# Altium schematic sheet Power_Supply.SchDoc (part 1 of 2)
size A3; SheetNumber: 3; SheetTotal: 4
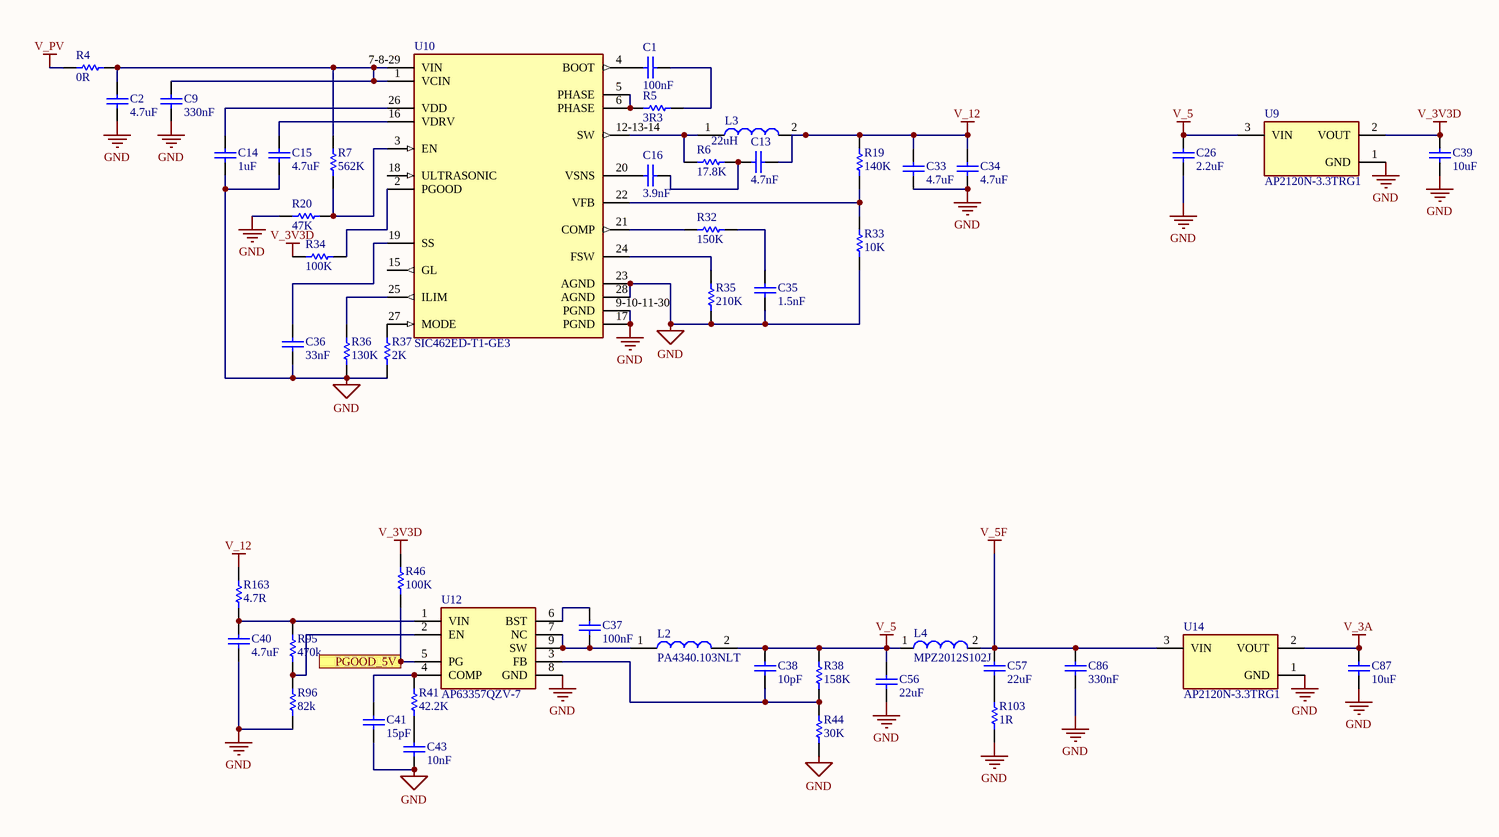
[diagram p0: Power_Supply.SchDoc]

## Parts
C1  100nF  [CAPC1005X56X25NL10T15]
C2  4.7uF  [CAPC3216X180X50NL20T25]
C9  330nF  [CAPC2013X140X50NL20T25]
C13  4.7nF  [CAPC1608X90X35NL10T15]
C14  1uF  [CAPC1608X90X35NL15T15]
C15  4.7uF  [CAPC2013X152X50NL20T25]
C16  3.9nF  [CAPC1608X90X35NL15T15]
C26  2.2uF  [CAPC2013X140X45NL15T25]
C33  4.7uF  [CAPC3216X180X50NL20T25]
C34  4.7uF  [CAPC3216X180X50NL20T25]
C35  1.5nF  [CAPC1608X90X35NL15T15]
C36  33nF  [CAPC1005X55X25NL05T10]
C37  100nF  [CAPC1005X56X25NL10T15]
C38  10pF  [CAPC1005X56X25NL10T15]
C39  10uF  [CAPC2013X140X45NL15T25]
C40  4.7uF  [CAPC3216X180X50NL20T25]
C41  15pF  [CAPC1005X56X25NL10T15]
C43  10nF  [CAPC1005X56X25NL10T15]
C56  22uF  [CAPC1206(3216)190_N]
C57  22uF  [CAPC1206(3216)190_M]
C86  330nF  [CAPC2013X140X45NL15T25]
C87  10uF  [CAPC2013X140X45NL15T25]
L2  PA4340.103NLT  [INDPM6054X300N]
L3  22uH  [INDPM8680X400N]
L4  MPZ2012S102J  [SMD-0805]
R4  0R  [RESC1608X55X25ML10T15]
R5  3R3  [RESC1005X40X25NL05T10]
R6  17.8K  [RESC1608X55X30NL15T15]
R7  562K  [RESC1609X50X30NL10T20]
R19  140K  [RESC1005X40X25NL05T05]
R20  47K  [RESC1608X55X30NL15T15]
R32  150K  [RESC1005X40X25NL05T05]
R33  10K  [RESC1005X40X25NL05T05]
R34  100K  [RESC1005X40X25NL05T10]
R35  210K  [RESC1005X40X25NL05T05]
R36  130K  [RESC1005X40X25NL05T10]
R37  2K  [RESC1005X40X25NL05T05]
R38  158K  [RESC1005X40X25NL05T05]
R41  42.2K  [RESC1005X40X25NL05T05]
R44  30K  [RESC1005X40X25NL05T05]
R46  100K  [RESC1005X40X25NL05T10]
R95  470k  [RESC1005X40X25NL05T05]
R96  82k  [RESC1005X40X25NL05T05]
R103  1R  [RESC2012X70N]
R163  4.7R  [RESC2013X70X40LL20T20]
U9  AP2120N-3.3TRG1  [FP-SOT23-MFG]
U10  SIC462ED-T1-GE3  [FP-T18-0594-MFG]
U12  AP63357QZV-7  [AP63357QZV7]
U14  AP2120N-3.3TRG1  [FP-SOT23-MFG]

## Ports
PGOOD_5V (out)

## Nets
GND: C2.1 C9.1 C14.1 C15.1 C26.1 C33.1 C34.1 C35.1 C36.1 C39.1 C40.1 C41.1 C43.1 C56.1 C86.1 C87.1 R20.1 R33.1 R35.1 R36.1 R37.1 R44.1 R96.1 R103.1 U9.1(GND) U10.9-10-11-30(PGND) U10.17(PGND) U10.23(AGND) U10.28(AGND) U12.8(GND) U14.1(GND)
V_3A: C87.2 U14.2(VOUT)
V_3V3D: C39.2 R34.1 R46.2 U9.2(VOUT)
V_5: C26.2 C38.2 C56.2 L2.2 L4.1 R38.2 U9.3(VIN)
V_5F: C57.1 C86.2 L4.2 U14.3(VIN)
V_12: C13.2 C33.2 C34.2 L3.2 R19.2 R163.2
V_PV: R4.2
PGOOD_5V: R46.1 U12.5(PG) ; port PGOOD_5V
NetC1_1: C1.1 U10.4(BOOT)
NetC1_2: C1.2 R5.2
NetC2_2: C2.2 C9.2 R4.1 R7.2 U10.1(VCIN) U10.7-8-29(VIN)
NetC13_1: C13.1 C16.2 R6.2
NetC14_2: C14.2 U10.26(VDD)
NetC15_2: C15.2 U10.16(VDRV)
NetC16_1: C16.1 U10.20(VSNS)
NetC35_2: C35.2 R32.1
NetC36_2: C36.2 U10.19(SS)
NetC37_1: C37.1 L2.1 U12.7(NC) U12.9(SW)
NetC37_2: C37.2 U12.6(BST)
NetC38_1: C38.1 R38.1 R44.2 U12.3(FB)
NetC40_2: C40.2 R95.2 R163.1 U12.1(VIN)
NetC41_2: C41.2 R41.2 U12.4(COMP)
NetC43_2: C43.2 R41.1
NetC57_2: C57.2 R103.2
NetL3_1: L3.1 R6.1 U10.12-13-14(SW)
NetR5_1: R5.1 U10.5(PHASE) U10.6(PHASE)
NetR7_1: R7.1 R20.2 U10.3(EN)
NetR19_1: R19.1 R33.2 U10.22(VFB)
NetR32_2: R32.2 U10.21(COMP)
NetR34_2: R34.2 U10.2(PGOOD)
NetR35_2: R35.2 U10.24(FSW)
NetR36_2: R36.2 U10.25(ILIM)
NetR37_2: R37.2 U10.27(MODE)
NetR95_1: R95.1 R96.2 U12.2(EN)

Not connected (* = marked no-connect by the designer): U10 15(GL) 18(ULTRASONIC)
## Library data of the parts
C1 C37 = CMP-2008-02800-1: AVX 0.1uF Multilayer Ceramic Capacitor (MLCC) 16 V dc 10% X7R dielectric 402 SMT max op. temp. +125C; Manufacturer: AVX Interconnect / Elco; Part Number: 0402YC104KAT2A; Voltage Rating: 16V; Supplier 1: Digi-Key; Supplier Part Number 1: 478-7888-1-ND; Manufacturer Part Number: 0402YC104KAT2A; RoHS: Yes; Category: Ceramic Capacitors; Stock 1: 72315; Pricing 1: 1=0.10000, 10=0.01600, 50=0.00860, 100=0.00700, 500=0.00500, 1000=0.00393, 2500=0.00358, 5000=0.00329 (USD); Mount: Surface Mount,PCB; Case/Package: 0402; Case Code (Metric): 1005; Case Code (Imperial): 0402; Dielectric Material: Ceramic; Contact Plating: Tin,Matte; Min Operating Temperature: -55°C; Max Operating Temperature: 125°C; Tolerance: 10%; Packaging: Tape and Reel; Capacitance: 100nF; Voltage Rating (DC): 16V; Dielectric: X7R; Voltage: 16V; Package Quantity: 1; Termination: SMD/SMT; Series: -; Construction: Flat; Length: 1mm; Width: 0.02inch; Height: 0.56mm; Thickness: 0.022inch; Depth: 0.5mm; Radiation Hardening: No; REACH SVHC: Unknown; RoHS Compliant: Yes; Lead Free: Lead Free; ComponentLink1URL: https://datasheet.ciiva.com/1123/1679506-1123956.pdf?src-supplier=Element14; ComponentLink1Description: https://datasheet.ciiva.com/1123/1679506-1123956.pdf?src-supplier=Element14; ComponentLink2URL: https://datasheet.ciiva.com/7614/cx7r-7614662.pdf?src-supplier=Digi-Key; ComponentLink2Description: https://datasheet.ciiva.com/7614/cx7r-7614662.pdf?src-supplier=Digi-Key; ComponentLink3URL: https://datasheet.ciiva.com/22693/1679506-22693578.pdf?src-supplier=Element14; ComponentLink3Description: https://datasheet.ciiva.com/22693/1679506-22693578.pdf?src-supplier=Element14; ComponentLink4URL: https://datasheet.ciiva.com/16623/cx7r-16623291.pdf?src-supplier=Avnet+Europe; ComponentLink4Description: https://datasheet.ciiva.com/16623/cx7r-16623291.pdf?src-supplier=Avnet+Europe; ComponentLink5URL: https://datasheet.ciiva.com/2987/cx7r-2987708.pdf?src-supplier=Avnet; ComponentLink5Description: https://datasheet.ciiva.com/2987/cx7r-2987708.pdf?src-supplier=Avnet; ComponentLink6URL: https://datasheet.ciiva.com/6265/cx7r-6265276.pdf?src-supplier=Digi-Key; ComponentLink6Description: https://datasheet.ciiva.com/6265/cx7r-6265276.pdf?src-supplier=Digi-Key; ComponentLink7URL: https://datasheet.ciiva.com/28613/1679506-28613260.pdf?src-supplier=Element14; ComponentLink7Description: https://datasheet.ciiva.com/28613/1679506-28613260.pdf?src-supplier=Element14; ComponentLink8URL: https://datasheet.ciiva.com/5411/cx7r-218113-5411197.pdf?src-supplier=Mouser; ComponentLink8Description: https://datasheet.ciiva.com/5411/cx7r-218113-5411197.pdf?src-supplier=Mouser; ComponentLink9URL: https://datasheet.ciiva.com/7709/1679506-7709566.pdf?src-supplier=Element14; ComponentLink9Description: https://datasheet.ciiva.com/7709/1679506-7709566.pdf?src-supplier=Element14
C2 C33 C34 C40 = CMP-2000-07581-1: Chip Capacitor, 4.7 uF, +/- 10%, 50 V, -55 to 125 degC, 1206 (3216 Metric), RoHS, Tape and Reel; Manufacturer: AVX; Manufacturer Part Number: 12065C475KAT2A; Voltage Rating: 50V; Case\/Package: 1206; Dissipation Factor: 2.5%; Dielectric: X7R; Case Code (Imperial): 1206; Tolerance: 10%; Radiation Hardening: No; Mount: SurfaceMount; Capacitance: 4.7uF; Width: 1.6mm; Manufacturer URL: http://www.avx.com/; RoHSCompliant: True; Thickness: 0.07inch; Depth: 1.6mm; Min Operating Temperature: -55degC; Package Reference: 1206; Voltage Rating (DC): 50V; Package Description: 2-Pin Surface Mount Device, Body 3.2 x 1.6 mm; Datasheet URL: http://datasheets.avx.com/X7RDielectric.pdf; Case Code (Metric): 3216; REACH SVHC: NoSVHC; Packaging: TapeandReel; Mounting Technology: SurfaceMount; Termination: SMD/SMT; Package Quantity: 1; Datasheet Version: 03/2017; Max Operating Temperature: 125degC; Contact Plating: Matte; Length: 3.2mm; Lead Free: LeadFree; Supplier 1: Digi-Key; Supplier Part Number 1: 478-6653-1-ND; RoHS: Yes; Category: Ceramic Capacitors; Stock 1: 241833; Pricing 1: 1=0.51000, 10=0.35400, 100=0.21250, 500=0.15940, 1000=0.13460 (USD); Case/Package: 1206; ComponentLink1URL: https://datasheet.ciiva.com/5410/cx7r-218113-5410549.pdf?src-supplier=Mouser; ComponentLink1Description: https://datasheet.ciiva.com/5410/cx7r-218113-5410549.pdf?src-supplier=Mouser; ComponentLink2URL: https://datasheet.ciiva.com/16387/flexiterm-16387141.pdf?src-supplier=Future+Electronics; ComponentLink2Description: https://datasheet.ciiva.com/16387/flexiterm-16387141.pdf?src-supplier=Future+Electronics; ComponentLink3URL: https://datasheet.ciiva.com/153/cx7r-153750.pdf?src-supplier=Digi-Key; ComponentLink3Description: https://datasheet.ciiva.com/153/cx7r-153750.pdf?src-supplier=Digi-Key; ComponentLink4URL: https://datasheet.ciiva.com/7833/cx7r-7833462.pdf?src-supplier=Element14; ComponentLink4Description: https://datasheet.ciiva.com/7833/cx7r-7833462.pdf?src-supplier=Element14; ComponentLink5URL: https://datasheet.ciiva.com/153/cx7r-153751.pdf?src-supplier=Digi-Key; ComponentLink5Description: https://datasheet.ciiva.com/153/cx7r-153751.pdf?src-supplier=Digi-Key; ComponentLink6URL: https://datasheet.ciiva.com/7833/cx7r-7833463.pdf?src-supplier=Element14; ComponentLink6Description: https://datasheet.ciiva.com/7833/cx7r-7833463.pdf?src-supplier=Element14; ComponentLink7URL: https://datasheet.ciiva.com/153/cx7r-153752.pdf?src-supplier=Digi-Key; ComponentLink7Description: https://datasheet.ciiva.com/153/cx7r-153752.pdf?src-supplier=Digi-Key
C9 = CMP-2007-03261-1: C0805C224K1RACAUTO; Manufacturer: Kemet; Dielectric Material: Ceramic; Tolerance: 10%; Capacitance: 220nF; Voltage Rating (DC): 100V; Dielectric: X7R; Part Number: C0805C224K1RACAUTO; Supplier 1: Digi-Key; Supplier Part Number 1: 399-6946-1-ND; Manufacturer Part Number: C0805C224K1RACAUTO; RoHS: Yes; Category: Ceramic Capacitors; Stock 1: 158113; Pricing 1: 1=0.37000, 10=0.25700, 100=0.15400, 500=0.11548, 1000=0.09752 (USD); Mount: Surface Mount; Case/Package: 0805; Case Code (Metric): 2012; Case Code (Imperial): 0805; Min Operating Temperature: -55°C; Max Operating Temperature: 125°C; Packaging: Tape and Reel; Voltage Rating: 100V; Package Quantity: 2500; Length: 2mm; Height: 1.25mm; Width: 0.049inch; Depth: 1.25mm; Thickness: 0.055inch; Ratings: AEC-Q200; Radiation Hardening: No; REACH SVHC: No SVHC; ComponentLink1URL: https://datasheet.ciiva.com/26948/getdatasheetpartid-385697-26948471.pdf?src-supplier=Verical; ComponentLink1Description: https://datasheet.ciiva.com/26948/getdatasheetpartid-385697-26948471.pdf?src-supplier=Verical; ComponentLink2URL: https://datasheet.ciiva.com/22699/1693454-22699750.pdf?src-supplier=Element14; ComponentLink2Description: https://datasheet.ciiva.com/22699/1693454-22699750.pdf?src-supplier=Element14; ComponentLink3URL: https://datasheet.ciiva.com/7842/1693454-7842284.pdf?src-supplier=Element14; ComponentLink3Description: https://datasheet.ciiva.com/7842/1693454-7842284.pdf?src-supplier=Element14
C13 = CMP-2006-02924-1: CAP CER 4700PF 50V X7R 0603; Part Number: GRM188R71H472KA01D; Manufacturer: Murata; Dielectric Material: Ceramic; Tolerance: 10%; Insulation Resistance: 10GR; Supplier 1: Farnell; Supplier Part Number 1: 8819971; Manufacturer Part Number: GRM188R71H472KA01D; RoHS: Yes; Category: Ceramic Capacitors; Pricing 1: 10=0.02680, 100=0.01390, 500=0.00940, 1000=0.00790, 2000=0.00690, 4000=0.00580, 20000=0.00430, 40000=0.00400 (GBP); Mount: Surface Mount; Case/Package: 0603; Number of Pins: 2; Case Code (Imperial): 0603; Case Code (Metric): 1608; Material: Ceramic; Min Operating Temperature: -55°C; Max Operating Temperature: 125°C; Capacitance: 4.7nF; Voltage Rating: 50V; Voltage Rating (DC): 50V; Packaging: Tape and Reel; Dielectric: X7R; Voltage: 50V; Series: GRM; Package Quantity: 1; Termination: SMD/SMT; Length: 1.6mm; Width: 0.8mm; Height: 0.8mm; Depth: 0.8mm; Thickness: 0.035inch; Radiation Hardening: No; RoHS Compliant: Yes; REACH SVHC: No SVHC; Lead Free: Lead Free; ComponentLink1URL: https://datasheet.ciiva.com/5412/product-5412608.pdf?src-supplier=Mouser; ComponentLink1Description: https://datasheet.ciiva.com/5412/product-5412608.pdf?src-supplier=Mouser; ComponentLink2URL: https://datasheet.ciiva.com/18102/getdatasheetpartid-75298-18102657.pdf?src-supplier=Verical; ComponentLink2Description: https://datasheet.ciiva.com/18102/getdatasheetpartid-75298-18102657.pdf?src-supplier=Verical; ComponentLink3URL: https://datasheet.ciiva.com/11787/0900766b8003061f-11787116.pdf?src-supplier=RSComponents; ComponentLink3Description: https://datasheet.ciiva.com/11787/0900766b8003061f-11787116.pdf?src-supplier=RSComponents; ComponentLink4URL: https://datasheet.ciiva.com/29201/451888-da-01-en-vs-kondensator-0603-29201828.pdf?src-supplier=Conrad; ComponentLink4Description: https://datasheet.ciiva.com/29201/451888-da-01-en-vs-kondensator-0603-29201828.pdf?src-supplier=Conrad; ComponentLink5URL: https://datasheet.ciiva.com/7937/4360-7937669.pdf?src-supplier=Element14; ComponentLink5Description: https://datasheet.ciiva.com/7937/4360-7937669.pdf?src-supplier=Element14; ComponentLink6URL: https://datasheet.ciiva.com/48428/nmgrm-data-en-48428597.pdf?src-supplier=Distrelec; ComponentLink6Description: https://datasheet.ciiva.com/48428/nmgrm-data-en-48428597.pdf?src-supplier=Distrelec; ComponentLink7URL: https://datasheet.ciiva.com/7937/4360-7937670.pdf?src-supplier=Element14; ComponentLink7Description: https://datasheet.ciiva.com/7937/4360-7937670.pdf?src-supplier=Element14; ComponentLink8URL: https://datasheet.ciiva.com/7937/4360-7937671.pdf?src-supplier=Element14; ComponentLink8Description: https://datasheet.ciiva.com/7937/4360-7937671.pdf?src-supplier=Element14; ComponentLink9URL: https://datasheet.ciiva.com/130/partnumbering-e-01-130733.pdf?src-supplier=Digi-Key; ComponentLink9Description: https://datasheet.ciiva.com/130/partnumbering-e-01-130733.pdf?src-supplier=Digi-Key; ComponentLink10URL: https://datasheet.ciiva.com/130/partnumbering-e-01-130734.pdf?src-supplier=Digi-Key; ComponentLink10Description: https://datasheet.ciiva.com/130/partnumbering-e-01-130734.pdf?src-supplier=Digi-Key; ComponentLink11URL: https://datasheet.ciiva.com/130/partnumbering-e-01-130735.pdf?src-supplier=Digi-Key; ComponentLink11Description: https://datasheet.ciiva.com/130/partnumbering-e-01-130735.pdf?src-supplier=Digi-Key
C14 = CMP-2006-02293-1: SMD, 1 µF, 10 V, 0603 [Metrisch 1608], ± 10%, X7R; Manufacturer: Kemet; Part Number: C0603C105K8RACTU; Dielectric Material: Ceramic; Voltage Rating: 10V; Dissipation Factor: 5%; Supplier 1: Digi-Key; Supplier Part Number 1: 399-11133-1-ND; Manufacturer Part Number: C0603C105K8RACTU; RoHS: Yes; Category: Ceramic Capacitors; Stock 1: 469408; Pricing 1: 1=0.10000, 10=0.05900, 50=0.03240, 100=0.02640, 500=0.01886, 1000=0.01482 (USD); Mount: Surface Mount; Case/Package: 0603; Case Code (Imperial): 0603; Case Code (Metric): 1608; Contact Plating: Tin,Matte; Min Operating Temperature: -55°C; Max Operating Temperature: 125°C; Packaging: Tape and Reel; Capacitance: 1uF; Package Quantity: 1; Voltage Rating (DC): 10V; Tolerance: 10%; Dielectric: X7R; Termination: SMD/SMT; Series: -; Construction: Flat; Length: 1.6mm; Width: 0.8mm; Height: 0.8mm; Thickness: 0.035inch; Depth: 0.8mm; Radiation Hardening: No; REACH SVHC: No SVHC; RoHS Compliant: Yes; ComponentLink1URL: https://datasheet.ciiva.com/18192/getdatasheetpartid-212378-18192743.pdf?src-supplier=Verical; ComponentLink1Description: https://datasheet.ciiva.com/18192/getdatasheetpartid-212378-18192743.pdf?src-supplier=Verical
C15 = CMP-2007-04518-1: Part Number: 0805YC475KAT2A; Manufacturer: AVX Interconnect / Elco; Tolerance: 10%; Voltage Rating (DC): 16V; Dielectric: X7R; Voltage: 10V; Dissipation Factor: 3.5%; Supplier 1: Digi-Key; Supplier Part Number 1: 478-5722-1-ND; Manufacturer Part Number: 0805YC475KAT2A; RoHS: Yes; Category: Ceramic Capacitors; Stock 1: 94071; Pricing 1: 1=0.46000, 10=0.31900, 50=0.22320, 100=0.19120, 500=0.14342, 1000=0.12112 (USD); Mount: Surface Mount; Case/Package: 0805; Number of Pins: 2; Case Code (Metric): 2012; Case Code (Imperial): 0805; Contact Plating: Tin,Matte; Min Operating Temperature: -55°C; Max Operating Temperature: 125°C; Package Quantity: 1; Capacitance: 4.7uF; Packaging: Tape and Reel; Termination: SMD/SMT; Voltage Rating: 16V; Series: -; Construction: Flat; Length: 2.01mm; Width: 0.049inch; Height: 1.52mm; Depth: 1.25mm; Thickness: 0.06inch; Radiation Hardening: No; REACH SVHC: No SVHC; Lead Free: Lead Free; RoHS Compliant: Yes; ComponentLink1URL: https://datasheet.ciiva.com/11787/0900766b80dc2409-11787157.pdf?src-supplier=RSComponents; ComponentLink1Description: https://datasheet.ciiva.com/11787/0900766b80dc2409-11787157.pdf?src-supplier=RSComponents; ComponentLink2URL: https://datasheet.ciiva.com/154/cx7r-154080.pdf?src-supplier=Digi-Key; ComponentLink2Description: https://datasheet.ciiva.com/154/cx7r-154080.pdf?src-supplier=Digi-Key; ComponentLink3URL: https://datasheet.ciiva.com/154/cx7r-154081.pdf?src-supplier=Digi-Key; ComponentLink3Description: https://datasheet.ciiva.com/154/cx7r-154081.pdf?src-supplier=Digi-Key; ComponentLink4URL: https://datasheet.ciiva.com/7812/cx7r-7812213.pdf?src-supplier=Element14; ComponentLink4Description: https://datasheet.ciiva.com/7812/cx7r-7812213.pdf?src-supplier=Element14; ComponentLink5URL: https://datasheet.ciiva.com/7812/cx7r-7812214.pdf?src-supplier=Element14; ComponentLink5Description: https://datasheet.ciiva.com/7812/cx7r-7812214.pdf?src-supplier=Element14; ComponentLink6URL: https://datasheet.ciiva.com/5414/cx7r-218113-5414810.pdf?src-supplier=Mouser; ComponentLink6Description: https://datasheet.ciiva.com/5414/cx7r-218113-5414810.pdf?src-supplier=Mouser; ComponentLink7URL: https://datasheet.ciiva.com/2988/cx7r-2988060.pdf?src-supplier=Avnet; ComponentLink7Description: https://datasheet.ciiva.com/2988/cx7r-2988060.pdf?src-supplier=Avnet; ComponentLink8URL: https://datasheet.ciiva.com/16389/cx7r-16389021.pdf?src-supplier=Future+Electronics; ComponentLink8Description: https://datasheet.ciiva.com/16389/cx7r-16389021.pdf?src-supplier=Future+Electronics; ComponentLink9URL: https://datasheet.ciiva.com/154/cx7r-154079.pdf?src-supplier=Digi-Key; ComponentLink9Description: https://datasheet.ciiva.com/154/cx7r-154079.pdf?src-supplier=Digi-Key; ComponentLink10URL: https://datasheet.ciiva.com/11570/cx7r-11570847.pdf?src-supplier=Avnet; ComponentLink10Description: https://datasheet.ciiva.com/11570/cx7r-11570847.pdf?src-supplier=Avnet
C16 = CMP-2006-04096-1: Part Number: 06031C392KAT2A; Manufacturer: AVX Interconnect / Elco; Dielectric Material: Ceramic; Tolerance: 10%; Voltage Rating (DC): 100V; Dielectric: X7R; Dissipation Factor: 2.5%; Supplier 1: Digi-Key; Supplier Part Number 1: 478-5001-1-ND; Manufacturer Part Number: 06031C392KAT2A; RoHS: Yes; Category: Ceramic Capacitors; Stock 1: 3576; Pricing 1: 1=0.23000, 10=0.15700, 50=0.09400, 100=0.07940, 500=0.05434, 1000=0.04807 (USD); Mount: Surface Mount,PCB; Case/Package: 0603; Number of Pins: 2; Case Code (Metric): 1608; Case Code (Imperial): 0603; Min Operating Temperature: -55°C; Max Operating Temperature: 125°C; Capacitance: 3.9nF; Packaging: Tape and Reel; Termination: SMD/SMT; Voltage Rating: 100V; Package Quantity: 1; Series: -; Construction: Flat; Voltage: 100V; Length: 1.6mm; Width: 0.032inch; Height: 0.86mm; Thickness: 0.035inch; Depth: 0.81mm; Radiation Hardening: No; RoHS Compliant: Yes; Lead Free: Lead Free; REACH SVHC: No SVHC; ComponentLink1URL: https://datasheet.ciiva.com/151/cx7r-151072.pdf?src-supplier=Digi-Key; ComponentLink1Description: https://datasheet.ciiva.com/151/cx7r-151072.pdf?src-supplier=Digi-Key; ComponentLink2URL: https://datasheet.ciiva.com/151/cx7r-151073.pdf?src-supplier=Digi-Key; ComponentLink2Description: https://datasheet.ciiva.com/151/cx7r-151073.pdf?src-supplier=Digi-Key; ComponentLink3URL: https://datasheet.ciiva.com/151/cx7r-151074.pdf?src-supplier=Digi-Key; ComponentLink3Description: https://datasheet.ciiva.com/151/cx7r-151074.pdf?src-supplier=Digi-Key; ComponentLink4URL: https://datasheet.ciiva.com/6013/84526-6013797.pdf?src-supplier=Farnell; ComponentLink4Description: https://datasheet.ciiva.com/6013/84526-6013797.pdf?src-supplier=Farnell; ComponentLink5URL: https://datasheet.ciiva.com/5416/cx7r-218113-5416073.pdf?src-supplier=Mouser; ComponentLink5Description: https://datasheet.ciiva.com/5416/cx7r-218113-5416073.pdf?src-supplier=Mouser; ComponentLink6URL: https://datasheet.ciiva.com/16214/cx7r-16214154.pdf?src-supplier=Future+Electronics; ComponentLink6Description: https://datasheet.ciiva.com/16214/cx7r-16214154.pdf?src-supplier=Future+Electronics; ComponentLink7URL: https://datasheet.ciiva.com/7855/84526-7855211.pdf?src-supplier=Element14; ComponentLink7Description: https://datasheet.ciiva.com/7855/84526-7855211.pdf?src-supplier=Element14; ComponentLink8URL: https://datasheet.ciiva.com/15212/getdatasheetpartid-150519-15212187.pdf?src-supplier=Verical; ComponentLink8Description: https://datasheet.ciiva.com/15212/getdatasheetpartid-150519-15212187.pdf?src-supplier=Verical; ComponentLink9URL: https://datasheet.ciiva.com/1124/1679506-1124300.pdf?src-supplier=Element14; ComponentLink9Description: https://datasheet.ciiva.com/1124/1679506-1124300.pdf?src-supplier=Element14; ComponentLink10URL: https://datasheet.ciiva.com/1124/1679506-1124301.pdf?src-supplier=Element14; ComponentLink10Description: https://datasheet.ciiva.com/1124/1679506-1124301.pdf?src-supplier=Element14
C26 C39 C86 C87 = CMP-2007-03395-1: Part Number: GRM21BR71A106KE51L; Manufacturer: Murata
C35 = CMP-2006-04080-1: Part Number: 06031C152JAT2A; Manufacturer: AVX Interconnect / Elco; Dielectric Material: Ceramic; Tolerance: 5%; Dielectric: X7R; Voltage Rating (DC): 100V; Supplier 1: Digi-Key; Supplier Part Number 1: 478-3703-1-ND; Manufacturer Part Number: 06031C152JAT2A; RoHS: Yes; Category: Ceramic Capacitors; Stock 1: 7561; Pricing 1: 1=0.29000, 10=0.20000, 50=0.12020, 100=0.10160, 500=0.06950, 1000=0.06148 (USD); Mount: Surface Mount,PCB; Case/Package: 0603; Number of Pins: 2; Case Code (Imperial): 0603; Case Code (Metric): 1608; Min Operating Temperature: -55°C; Max Operating Temperature: 125°C; Capacitance: 1.5nF; Packaging: Tape and Reel; Termination: SMD/SMT; Package Quantity: 1; Voltage Rating: 100V; Series: -; Construction: Flat; Voltage: 100V; Length: 1.6mm; Width: 0.81mm; Height: 0.9mm; Depth: 0.81mm; Thickness: 0.035inch; Radiation Hardening: No; RoHS Compliant: Yes; REACH SVHC: No SVHC; Lead Free: Lead Free; ComponentLink1URL: https://datasheet.ciiva.com/5418/cx7r-218113-5418085.pdf?src-supplier=Mouser; ComponentLink1Description: https://datasheet.ciiva.com/5418/cx7r-218113-5418085.pdf?src-supplier=Mouser; ComponentLink2URL: https://datasheet.ciiva.com/151/cx7r-151639.pdf?src-supplier=Digi-Key; ComponentLink2Description: https://datasheet.ciiva.com/151/cx7r-151639.pdf?src-supplier=Digi-Key; ComponentLink3URL: https://datasheet.ciiva.com/14591/70001075-14591735.pdf?src-supplier=Allied+Electronics; ComponentLink3Description: https://datasheet.ciiva.com/14591/70001075-14591735.pdf?src-supplier=Allied+Electronics; ComponentLink4URL: https://datasheet.ciiva.com/151/cx7r-151640.pdf?src-supplier=Digi-Key; ComponentLink4Description: https://datasheet.ciiva.com/151/cx7r-151640.pdf?src-supplier=Digi-Key; ComponentLink5URL: https://datasheet.ciiva.com/6106/84526-6106520.pdf?src-supplier=Farnell; ComponentLink5Description: https://datasheet.ciiva.com/6106/84526-6106520.pdf?src-supplier=Farnell; ComponentLink6URL: https://datasheet.ciiva.com/151/cx7r-151641.pdf?src-supplier=Digi-Key; ComponentLink6Description: https://datasheet.ciiva.com/151/cx7r-151641.pdf?src-supplier=Digi-Key; ComponentLink7URL: https://datasheet.ciiva.com/11499/cx7r-11499674.pdf?src-supplier=Avnet; ComponentLink7Description: https://datasheet.ciiva.com/11499/cx7r-11499674.pdf?src-supplier=Avnet; ComponentLink8URL: https://datasheet.ciiva.com/1124/1679506-1124251.pdf?src-supplier=Element14; ComponentLink8Description: https://datasheet.ciiva.com/1124/1679506-1124251.pdf?src-supplier=Element14; ComponentLink9URL: https://datasheet.ciiva.com/1124/1679506-1124252.pdf?src-supplier=Element14; ComponentLink9Description: https://datasheet.ciiva.com/1124/1679506-1124252.pdf?src-supplier=Element14; ComponentLink10URL: https://datasheet.ciiva.com/7855/1679506-7855036.pdf?src-supplier=Element14; ComponentLink10Description: https://datasheet.ciiva.com/7855/1679506-7855036.pdf?src-supplier=Element14; ComponentLink11URL: https://datasheet.ciiva.com/7855/84526-7855198.pdf?src-supplier=Element14; ComponentLink11Description: https://datasheet.ciiva.com/7855/84526-7855198.pdf?src-supplier=Element14; ComponentLink12URL: https://datasheet.ciiva.com/16623/cx7r-16623310.pdf?src-supplier=Avnet+Europe; ComponentLink12Description: https://datasheet.ciiva.com/16623/cx7r-16623310.pdf?src-supplier=Avnet+Europe
C36 = CMP-1034-01988-2: Part Number: GRM155R71E333KA88D; Manufacturer: Murata; Material: Ceramic; Voltage Rating: 25V; Tolerance: 10%; Dielectric: X7R; Supplier 1: Digi-Key; Supplier Part Number 1: 490-3253-1-ND; Manufacturer Part Number: GRM155R71E333KA88D; RoHS: Yes; Category: Ceramic Capacitors; Stock 1: 49115; Pricing 1: 1=0.10000, 10=0.07100, 50=0.03900, 100=0.03180, 500=0.02272, 1000=0.01785, 2500=0.01622, 5000=0.01493 (USD); Mount: Surface Mount; Case/Package: 0402; Number of Pins: 2; Case Code (Imperial): 0402; Case Code (Metric): 1005; Min Operating Temperature: -55°C; Max Operating Temperature: 125°C; Capacitance: 33nF; Packaging: Tape and Reel; Voltage Rating (DC): 25V; Package Quantity: 1; Termination: SMD/SMT; Voltage: 25V; Length: 1mm; Width: 0.02inch; Height: 0.5mm; Thickness: 0.022inch; Depth: 0.5mm; Radiation Hardening: No; RoHS Compliant: Yes; Lead Free: Lead Free; REACH SVHC: No SVHC; ComponentLink1URL: https://datasheet.ciiva.com/131/product-131792.pdf?src-supplier=Digi-Key; ComponentLink1Description: https://datasheet.ciiva.com/131/product-131792.pdf?src-supplier=Digi-Key; ComponentLink2URL: https://datasheet.ciiva.com/18184/getdatasheetpartid-153135-18184704.pdf?src-supplier=Verical; ComponentLink2Description: https://datasheet.ciiva.com/18184/getdatasheetpartid-153135-18184704.pdf?src-supplier=Verical; ComponentLink3URL: https://datasheet.ciiva.com/19467/1856417-19467732.pdf?src-supplier=Jameco; ComponentLink3Description: https://datasheet.ciiva.com/19467/1856417-19467732.pdf?src-supplier=Jameco; ComponentLink4URL: https://datasheet.ciiva.com/29199/454166-da-01-en-vs-kondensator-0402-29199822.pdf?src-supplier=Conrad; ComponentLink4Description: https://datasheet.ciiva.com/29199/454166-da-01-en-vs-kondensator-0402-29199822.pdf?src-supplier=Conrad; ComponentLink5URL: https://datasheet.ciiva.com/2989/product-2989392.pdf?src-supplier=Avnet; ComponentLink5Description: https://datasheet.ciiva.com/2989/product-2989392.pdf?src-supplier=Avnet; ComponentLink6URL: https://datasheet.ciiva.com/131/grm155r71e333ka88-01-131793.pdf?src-supplier=Digi-Key; ComponentLink6Description: https://datasheet.ciiva.com/131/grm155r71e333ka88-01-131793.pdf?src-supplier=Digi-Key; ComponentLink7URL: https://datasheet.ciiva.com/131/grm155r71e333ka88-01-131794.pdf?src-supplier=Digi-Key; ComponentLink7Description: https://datasheet.ciiva.com/131/grm155r71e333ka88-01-131794.pdf?src-supplier=Digi-Key; ComponentLink8URL: https://datasheet.ciiva.com/7937/608985-7937622.pdf?src-supplier=Element14; ComponentLink8Description: https://datasheet.ciiva.com/7937/608985-7937622.pdf?src-supplier=Element14; ComponentLink9URL: https://datasheet.ciiva.com/14103/grmseries-highdielectrictype-eng-14103753.pdf?src-supplier=Distrelec; ComponentLink9Description: https://datasheet.ciiva.com/14103/grmseries-highdielectrictype-eng-14103753.pdf?src-supplier=Distrelec; ComponentLink10URL: https://datasheet.ciiva.com/16208/product-16208394.pdf?src-supplier=Future+Electronics; ComponentLink10Description: https://datasheet.ciiva.com/16208/product-16208394.pdf?src-supplier=Future+Electronics; ComponentLink11URL: https://datasheet.ciiva.com/2989/product-2989391.pdf?src-supplier=Avnet; ComponentLink11Description: https://datasheet.ciiva.com/2989/product-2989391.pdf?src-supplier=Avnet
C38 = CMP-2008-02563-1: CERAMIC CAPACITOR, 10PF, 50V, C0G, 5%, SMD, FULL REEL; Product Range:-; Capacitance:10pF; Capacitance Tolerance: 5%; Dielectric Characteristic:C0G / NP0; Voltage Rating:50V; Ceramic Capacitor Case:0402 [1005 Metric]; No. of Pins:2 ;RoHS Compliant: Yes; Part Number: 04025A100DAT2A; Manufacturer: AVX Interconnect / Elco; Temperature Coefficient: 30ppm/°C; Supplier 1: Digi-Key; Supplier Part Number 1: 478-7870-1-ND; Manufacturer Part Number: 04025A100DAT2A; RoHS: Yes; Category: Ceramic Capacitors; Stock 1: 172687; Pricing 1: 1=0.30000, 10=0.20700, 50=0.13800, 100=0.11730, 500=0.08280, 1000=0.07245, 2500=0.06900, 5000=0.06382 (USD); Mount: Surface Mount; Case/Package: 0402; Number of Pins: 2; Case Code (Metric): 1005; Case Code (Imperial): 0402; Dielectric Material: Ceramic; Contact Plating: Tin,Matte; Min Operating Temperature: -55°C; Max Operating Temperature: 125°C; Capacitance: 10pF; Voltage Rating: 50V; Voltage Rating (DC): 50V; Package Quantity: 1; Packaging: Tape and Reel; Dielectric: C0G; Termination: SMD/SMT; Series: -; Tolerance: 5%; Construction: Flat; Voltage: 50V; Length: 1mm; Width: 0.02inch; Height: 0.56mm; Depth: 0.5mm; Thickness: 0.022inch; Radiation Hardening: No; RoHS Compliant: Yes; REACH SVHC: No SVHC; Lead Free: Lead Free; ComponentLink1URL: https://datasheet.ciiva.com/11788/0900766b80def0e2-11788539.pdf?src-supplier=RSComponents; ComponentLink1Description: https://datasheet.ciiva.com/11788/0900766b80def0e2-11788539.pdf?src-supplier=RSComponents; ComponentLink2URL: https://datasheet.ciiva.com/2990/ccog-2990165.pdf?src-supplier=Avnet; ComponentLink2Description: https://datasheet.ciiva.com/2990/ccog-2990165.pdf?src-supplier=Avnet; ComponentLink3URL: https://datasheet.ciiva.com/16623/ccog-16623350.pdf?src-supplier=Avnet+Europe; ComponentLink3Description: https://datasheet.ciiva.com/16623/ccog-16623350.pdf?src-supplier=Avnet+Europe; ComponentLink4URL: https://datasheet.ciiva.com/14906/ccog-14906265.pdf?src-supplier=Digi-Key; ComponentLink4Description: https://datasheet.ciiva.com/14906/ccog-14906265.pdf?src-supplier=Digi-Key; ComponentLink5URL: https://datasheet.ciiva.com/206/ccog-206459.pdf?src-supplier=Digi-Key; ComponentLink5Description: https://datasheet.ciiva.com/206/ccog-206459.pdf?src-supplier=Digi-Key; ComponentLink6URL: https://datasheet.ciiva.com/14906/ccog-14906267.pdf?src-supplier=Digi-Key; ComponentLink6Description: https://datasheet.ciiva.com/14906/ccog-14906267.pdf?src-supplier=Digi-Key; ComponentLink7URL: https://datasheet.ciiva.com/1123/ccog-1123468.pdf?src-supplier=Element14; ComponentLink7Description: https://datasheet.ciiva.com/1123/ccog-1123468.pdf?src-supplier=Element14; ComponentLink8URL: https://datasheet.ciiva.com/1123/ccog-1123469.pdf?src-supplier=Element14; ComponentLink8Description: https://datasheet.ciiva.com/1123/ccog-1123469.pdf?src-supplier=Element14
C41 = CMP-1034-00812-2: Cap Ceramic 15pF 50V C0G 1% SMD 0402 125C Paper T/R; Manufacturer: AVX Interconnect / Elco; Part Number: 04025A150FAT2A; Supplier 1: Digi-Key; Supplier Part Number 1: 478-5126-1-ND; Manufacturer Part Number: 04025A150FAT2A; RoHS: Yes; Category: Ceramic Capacitors; Stock 1: 101927; Pricing 1: 1=0.57000, 10=0.40100, 50=0.30300, 100=0.26390, 500=0.19550, 1000=0.16618, 2500=0.15640, 5000=0.14662 (USD); Mount: Surface Mount,PCB; Case/Package: 0402; Number of Pins: 2; Case Code (Metric): 1005; Case Code (Imperial): 0402; Dielectric Material: Ceramic; Min Operating Temperature: -55°C; Max Operating Temperature: 125°C; Package Quantity: 1; Capacitance: 15pF; Voltage Rating: 50V; Tolerance: 1%; Packaging: Tape and Reel; Voltage Rating (DC): 50V; Dielectric: C0G; Termination: SMD/SMT; Series: -; Construction: Flat; Voltage: 50V; Length: 1mm; Width: 0.02inch; Height: 0.56mm; Depth: 0.5mm; Thickness: 0.022inch; Radiation Hardening: No; REACH SVHC: No SVHC; Lead Free: Lead Free; RoHS Compliant: Yes; ComponentLink1URL: https://datasheet.ciiva.com/26927/getdatasheetpartid-379176-26927300.pdf?src-supplier=Verical; ComponentLink1Description: https://datasheet.ciiva.com/26927/getdatasheetpartid-379176-26927300.pdf?src-supplier=Verical; ComponentLink2URL: https://datasheet.ciiva.com/157/ccog-157986.pdf?src-supplier=Digi-Key; ComponentLink2Description: https://datasheet.ciiva.com/157/ccog-157986.pdf?src-supplier=Digi-Key; ComponentLink3URL: https://datasheet.ciiva.com/157/ccog-157987.pdf?src-supplier=Digi-Key; ComponentLink3Description: https://datasheet.ciiva.com/157/ccog-157987.pdf?src-supplier=Digi-Key; ComponentLink4URL: https://datasheet.ciiva.com/157/ccog-157988.pdf?src-supplier=Digi-Key; ComponentLink4Description: https://datasheet.ciiva.com/157/ccog-157988.pdf?src-supplier=Digi-Key; ComponentLink5URL: https://datasheet.ciiva.com/14603/70001039-14603477.pdf?src-supplier=Allied+Electronics; ComponentLink5Description: https://datasheet.ciiva.com/14603/70001039-14603477.pdf?src-supplier=Allied+Electronics; ComponentLink6URL: https://datasheet.ciiva.com/28453/1796416-28453769.pdf?src-supplier=Element14; ComponentLink6Description: https://datasheet.ciiva.com/28453/1796416-28453769.pdf?src-supplier=Element14; ComponentLink7URL: https://datasheet.ciiva.com/22619/1796416-22619722.pdf?src-supplier=Element14; ComponentLink7Description: https://datasheet.ciiva.com/22619/1796416-22619722.pdf?src-supplier=Element14; ComponentLink8URL: https://datasheet.ciiva.com/11568/ccog-11568587.pdf?src-supplier=Avnet; ComponentLink8Description: https://datasheet.ciiva.com/11568/ccog-11568587.pdf?src-supplier=Avnet
C43 = CMP-2008-02925-1: Manufacturer: AVX Interconnect / Elco; Part Number: 04023C103JAT2A; Tolerance: 5%; Voltage Rating: 25V; Dielectric: X7R; Supplier 1: Digi-Key; Supplier Part Number 1: 478-7867-1-ND; Manufacturer Part Number: 04023C103JAT2A; RoHS: Yes; Category: Ceramic Capacitors; Stock 1: 9321; Pricing 1: 1=0.35000, 10=0.24300, 50=0.16980, 100=0.14560, 500=0.10920, 1000=0.09221, 2500=0.08735, 5000=0.08250 (USD); Mount: Surface Mount; Case/Package: 0402; Number of Pins: 2; Case Code (Imperial): 0402; Case Code (Metric): 1005; Min Operating Temperature: -55°C; Max Operating Temperature: 125°C; Packaging: Tape and Reel; Capacitance: 10nF; Package Quantity: 1; Voltage Rating (DC): 25V; Termination: SMD/SMT; Series: -; Construction: Flat; Length: 1mm; Width: 0.5mm; Thickness: 0.022inch; Depth: 0.5mm; Radiation Hardening: No; RoHS Compliant: Yes; Lead Free: Lead Free; ComponentLink1URL: https://datasheet.ciiva.com/11499/cx7r-11499815.pdf?src-supplier=Avnet; ComponentLink1Description: https://datasheet.ciiva.com/11499/cx7r-11499815.pdf?src-supplier=Avnet; ComponentLink2URL: https://datasheet.ciiva.com/5424/cx7r-218113-5424201.pdf?src-supplier=Mouser; ComponentLink2Description: https://datasheet.ciiva.com/5424/cx7r-218113-5424201.pdf?src-supplier=Mouser; ComponentLink3URL: https://datasheet.ciiva.com/7614/cx7r-7614730.pdf?src-supplier=Digi-Key; ComponentLink3Description: https://datasheet.ciiva.com/7614/cx7r-7614730.pdf?src-supplier=Digi-Key; ComponentLink4URL: https://datasheet.ciiva.com/208/cx7r-208205.pdf?src-supplier=Digi-Key; ComponentLink4Description: https://datasheet.ciiva.com/208/cx7r-208205.pdf?src-supplier=Digi-Key; ComponentLink5URL: https://datasheet.ciiva.com/14906/cx7r-14906237.pdf?src-supplier=Digi-Key; ComponentLink5Description: https://datasheet.ciiva.com/14906/cx7r-14906237.pdf?src-supplier=Digi-Key; ComponentLink6URL: https://datasheet.ciiva.com/16397/cx7r-16397645.pdf?src-supplier=Future+Electronics; ComponentLink6Description: https://datasheet.ciiva.com/16397/cx7r-16397645.pdf?src-supplier=Future+Electronics; ComponentLink7URL: https://datasheet.ciiva.com/14906/cx7r-14906238.pdf?src-supplier=Digi-Key; ComponentLink7Description: https://datasheet.ciiva.com/14906/cx7r-14906238.pdf?src-supplier=Digi-Key
C56 C57 = CMP-1037-04985-1: CAP 22uF 6.3V ±10% 1206 (3216 Metric) Thickness 1.9mm SMD; Manufacturer: Kyocera AVX; Manufacturer Part Number: 12066C226KAT2A; Tolerance: Â±10%; Case-EIA: 1206; Case-Metric: 3216; Dielectric: X7R; Dissipation Factor: 5%; Technology: SMT; Rated Voltage: 6.3 V; Max Thickness: 1.9 mm; Value: 22uF; Supplier 1: Digi-Key; Supplier Part Number 1: 478-5997-1-ND; RoHS: Yes; Category: Ceramic Capacitors; Stock 1: 4915; Pricing 1: 1=0.81000, 10=0.57100, 100=0.37570, 500=0.27830, 1000=0.23656 (USD); Mount: Surface Mount; Case/Package: 1206; Number of Pins: 2; Case Code (Imperial): 1206; Case Code (Metric): 3216; Contact Plating: Tin,Matte; Min Operating Temperature: -55°C; Max Operating Temperature: 125°C; Capacitance: 22uF; Voltage Rating: 6.3V; Packaging: Tape and Reel; Package Quantity: 2500; Termination: SMD/SMT; Voltage Rating (DC): 6.3V; Voltage: 6.3V; Length: 3.2mm; Height: 1.78mm; Width: 1.6mm; Depth: 1.6mm; Thickness: 0.07inch; Radiation Hardening: No; REACH SVHC: No SVHC; Lead Free: Lead Free; ComponentLink1URL: https://datasheet.ciiva.com/11786/0900766b80dc2409-11786266.pdf?src-supplier=RSComponents; ComponentLink1Description: https://datasheet.ciiva.com/11786/0900766b80dc2409-11786266.pdf?src-supplier=RSComponents; ComponentLink2URL: https://datasheet.ciiva.com/16315/cx7r-16315655.pdf?src-supplier=Future+Electronics; ComponentLink2Description: https://datasheet.ciiva.com/16315/cx7r-16315655.pdf?src-supplier=Future+Electronics; ComponentLink3URL: https://datasheet.ciiva.com/154/cx7r-154924.pdf?src-supplier=Digi-Key; ComponentLink3Description: https://datasheet.ciiva.com/154/cx7r-154924.pdf?src-supplier=Digi-Key; ComponentLink4URL: https://datasheet.ciiva.com/154/cx7r-154925.pdf?src-supplier=Digi-Key; ComponentLink4Description: https://datasheet.ciiva.com/154/cx7r-154925.pdf?src-supplier=Digi-Key; ComponentLink5URL: https://datasheet.ciiva.com/154/cx7r-154926.pdf?src-supplier=Digi-Key; ComponentLink5Description: https://datasheet.ciiva.com/154/cx7r-154926.pdf?src-supplier=Digi-Key
L2 = PA4340.472NLT: Inductor 10uH; Manufacturer_Name: Pulse; Datasheet Link: https://www.arrow.com/en/products/pa4340.472nlt/pulse-electronics-corporation; Height: 3mm; Manufacturer_Part_Number: PA4340.103NLT; Mouser Part Number: PA4340.103NLT; Mouser Price/Stock: https://www.mouser.co.uk/ProductDetail/Pulse-Electronics/PA4340472NLT?qs=%2FzQKu7YvIMZTHJkuI7emsg%3D%3D; Arrow Part Number: PA4340.472NLT; Arrow Price/Stock: https://www.arrow.com/en/products/pa4340.472nlt/pulse-electronics-corporation
L3 = MPX1D0840L470: Inductor 22uH; Manufacturer_Name: Kemet; Manufacturer_Part_Number: MPX1D0840L220; Datasheet Link: https://componentsearchengine.com/Datasheets/1/MPX1D0840L470.pdf; Height: 4mm; Mouser Part Number: 80-MPX1D0840L220; Mouser Price/Stock: https://www.mouser.com/Search/Refine.aspx?Keyword=80-MPX1D0840L470
L4 = CMP-0220-00149-1: SMD EMI Suppression Ferrite Bead WE-CBF, Z = 1500 Ohm; PackageDescription: Chip Inductor, 2-Leads, Body 2.0 x 1.2 mm; PackageReference: SMD-0805; DatasheetVersion: Dec-2005; PackageVersion: 2005; Impedance: 1500 Ohm; ComponentLink1URL: http://www.we-online.com; ComponentLink2URL: http://www.we-online.de/katalog/media/pdf/742792097.pdf; ComponentLink2Description: Datasheet; ComponentLink1Description: Manufacturer Link
R4 = CMP-2100-03667-1: Chip Resistor, 0 Ohm, +/- 5%, 0.1 W, -55 to 155 degC, 0603 (1608 Metric), RoHS, Tape and Reel; Manufacturer: Yageo; Temperature Coefficient: 200ppm/degreesC; Voltage Rating: 50V; Power Rating: 100mW; Resistance: 0mOhm; Width: 0.8mm; Max Operating Temperature: 155degC; Tolerance: 5%; Package Reference: 0603; Height: 0.45mm; Depth: 0.8mm; Package Description: 2-Pin Surface Mount Device, Body 1.6 x 0.8 mm; Termination: SMD/SMT; Package Quantity: 5000; Case/Package: 0603; Case Code (Imperial): 0603; Radiation Hardening: No; Number of Pins: 2; Length: 1.6mm; Lead Free: LeadFree; Voltage Rating (DC): 50V; Military Standard: Not; Datasheet URL: http://www.yageo.com/NewPortal/yageodocoutput?fileName=/pdf/R-Chip/PYu-RC_Group_51_RoHS_L_5.pdf; Manufacturer URL: http://www.yageo.com/; Packaging: TapeandReel; Case Code (Metric): 1608; Min Operating Temperature: -55degC; Composition: ThickFilm; RoHSCompliant: true; Contact Plating: Tin; Datasheet Version: Rev. 5, 10/2016; REACH SVHC: NoSVHC
R5 = CMP-2002-07060-1: Res Thick Film 0402 3.3 Ohm 1% 1/16W ±200ppm/°C Molded SMD Paper T/R; Manufacturer: Yageo / Phycomp; Part Number: RC0402FR-073R3L; Power Rating: 63mW; Resistance: 3.3R; Voltage Rating: 50V; Supplier 1: Digi-Key; Supplier Part Number 1: 311-3.30LRCT-ND; Manufacturer Part Number: RC0402FR-073R3L; RoHS: Yes; Category: Chip SMD Resistors; Stock 1: 461211; Pricing 1: 1=0.10000, 10=0.02400, 100=0.00960, 1000=0.00431, 2500=0.00374, 5000=0.00309 (USD); Case/Package: 0402; Case Code (Imperial): 0402; Case Code (Metric): 1005; Contact Plating: Tin,Matte; Size Code: 0402; Min Operating Temperature: -55°C; Max Operating Temperature: 155°C; Tolerance: 1%; Packaging: Tape and Reel; Resistor Type: Thick Film; Temperature Coefficient: 200ppm/°C; Series: RC; Max Power Dissipation: 63mW; Number of Terminations: 2; Construction: Rectangular; Voltage Rating (DC): 50V; Features: Moisture Resistant; Termination: SMD/SMT; Resistance Tolerance: 1%; Length: 1mm; Depth: 0.5mm; RoHS Compliant: Yes; Military Standard: Not; Lead Free: Lead Free; REACH SVHC: Unknown; ComponentLink1URL: https://datasheet.ciiva.com/28412/pyu-rc0402-51-rohs-l-6-28412729.pdf?src-supplier=Avnet+Europe; ComponentLink1Description: https://datasheet.ciiva.com/28412/pyu-rc0402-51-rohs-l-6-28412729.pdf?src-supplier=Avnet+Europe; ComponentLink2URL: https://datasheet.ciiva.com/16856/pyu-rc0402-51-rohs-l-6-16856956.pdf?src-supplier=Avnet+Europe; ComponentLink2Description: https://datasheet.ciiva.com/16856/pyu-rc0402-51-rohs-l-6-16856956.pdf?src-supplier=Avnet+Europe; ComponentLink3URL: https://datasheet.ciiva.com/7849/1018594-7849999.pdf?src-supplier=Element14; ComponentLink3Description: https://datasheet.ciiva.com/7849/1018594-7849999.pdf?src-supplier=Element14; ComponentLink4URL: https://datasheet.ciiva.com/8893/pyu-rc0402-51-rohs-l-6-8893711.pdf?src-supplier=Avnet; ComponentLink4Description: https://datasheet.ciiva.com/8893/pyu-rc0402-51-rohs-l-6-8893711.pdf?src-supplier=Avnet
R6 = CMP-1012-00649-2: RESISTOR, THICK FILM, 17.8KOHM, 0603, 100mW, ± 1%; Part Number: ERJ-3EKF1782V; Manufacturer: Panasonic; Manufacturer Part Number: ERJ3EKF1782V; Resistance: 17.8kR; Temperature Coefficient: 100ppm/°C; Voltage Rating (DC): 50V; Voltage Rating: 75V; Supplier 1: Digi-Key; Supplier Part Number 1: P17.8KHCT-ND; RoHS: Yes; Category: Chip SMD Resistors; Stock 1: 36180; Pricing 1: 1=0.10000, 10=0.03500, 100=0.01430, 1000=0.00644, 2500=0.00559 (USD); Mount: Surface Mount; Case/Package: 0603; Case Code (Metric): 1608; Case Code (Imperial): 0603; Contact Plating: Tin; Min Operating Temperature: -55°C; Max Operating Temperature: 155°C; Tolerance: 1%; Packaging: Tape and Reel; Resistor Type: Thick Film; Number of Terminations: 2; Max Power Dissipation: 100mW; Series: ERJ; Power Rating: 100mW; Package Quantity: 5000; Resistance Tolerance: 1%; Termination: SMD/SMT; Construction: Rectangular; Features: Automotive AEC-Q200; Technology: THICK FILM; Length: 1.6mm; Width: 0.031inch; Height: 0.45mm; Depth: 0.8mm; RoHS Compliant: Yes; Lead Free: Contains Lead; REACH SVHC: Unknown; Military Standard: Not; ComponentLink1URL: https://datasheet.ciiva.com/16772/70260748-16772757.pdf?src-supplier=Allied+Electronics; ComponentLink1Description: https://datasheet.ciiva.com/16772/70260748-16772757.pdf?src-supplier=Allied+Electronics; ComponentLink2URL: https://datasheet.ciiva.com/9192/aoa0000ce2-9192457.pdf?src-supplier=Avnet; ComponentLink2Description: https://datasheet.ciiva.com/9192/aoa0000ce2-9192457.pdf?src-supplier=Avnet; ComponentLink3URL: https://datasheet.ciiva.com/46420/1678782-46420090.pdf?src-supplier=Element14; ComponentLink3Description: https://datasheet.ciiva.com/46420/1678782-46420090.pdf?src-supplier=Element14; ComponentLink4URL: https://datasheet.ciiva.com/16764/70260748-16764715.pdf?src-supplier=Allied+Electronics; ComponentLink4Description: https://datasheet.ciiva.com/16764/70260748-16764715.pdf?src-supplier=Allied+Electronics; ComponentLink5URL: https://datasheet.ciiva.com/9192/aoa0000ce2-9192460.pdf?src-supplier=Avnet; ComponentLink5Description: https://datasheet.ciiva.com/9192/aoa0000ce2-9192460.pdf?src-supplier=Avnet; ComponentLink6URL: https://datasheet.ciiva.com/24026/aoa0000ce2-24026989.pdf?src-supplier=Mouser; ComponentLink6Description: https://datasheet.ciiva.com/24026/aoa0000ce2-24026989.pdf?src-supplier=Mouser; ComponentLink7URL: https://datasheet.ciiva.com/28594/1694929-28594623.pdf?src-supplier=Element14; ComponentLink7Description: https://datasheet.ciiva.com/28594/1694929-28594623.pdf?src-supplier=Element14; ComponentLink8URL: https://datasheet.ciiva.com/30077/aoa0000ce2-30077535.pdf?src-supplier=Onlinecomponents.com; ComponentLink8Description: https://datasheet.ciiva.com/30077/aoa0000ce2-30077535.pdf?src-supplier=Onlinecomponents.com
R7 = CMP-2000-03465-1: RES, THICK FILM, 562K, 1%, 0.1W, 0603; Part Number: CRCW0603562KFKEA; Manufacturer: Vishay Dale; Resistance: 562kR; Temperature Coefficient: 100ppm/°C; Power Rating: 100mW; Voltage Rating: 75V; Supplier 1: Digi-Key; Supplier Part Number 1: 541-562KHCT-ND; Manufacturer Part Number: CRCW0603562KFKEA; RoHS: Yes; Category: Chip SMD Resistors; Stock 1: 38128; Pricing 1: 1=0.10000, 10=0.03400, 100=0.01390, 1000=0.00624, 2500=0.00542 (USD); Case/Package: 0603; Number of Pins: 2; Case Code (Metric): 1608; Case Code (Imperial): 0603; Contact Plating: Tin; Weight: 7.1E-05oz; Min Operating Temperature: -55°C; Max Operating Temperature: 155°C; Tolerance: 1%; Packaging: Tape and Reel; Resistor Type: Thick Film; Number of Terminations: 2; Max Power Dissipation: 100mW; Series: CRCW; Voltage Rating (DC): 75V; Termination: SMD/SMT; Features: Automotive AEC-Q200; Package Quantity: 10; Construction: Rectangular; Resistance Tolerance: 1%; Technology: THICK FILM; Working Voltage: 75V; Length: 1.55mm; Width: 0.033inch; Height: 0.45mm; Depth: 0.85mm; Radiation Hardening: No; RoHS Compliant: Yes; Lead Free: Lead Free; Military Standard: Not; REACH SVHC: Unknown; ComponentLink1URL: https://datasheet.ciiva.com/2525/dcrcwe3-2525458.pdf?src-supplier=Digi-Key; ComponentLink1Description: https://datasheet.ciiva.com/2525/dcrcwe3-2525458.pdf?src-supplier=Digi-Key; ComponentLink2URL: https://datasheet.ciiva.com/2525/dcrcwe3-2525459.pdf?src-supplier=Digi-Key; ComponentLink2Description: https://datasheet.ciiva.com/2525/dcrcwe3-2525459.pdf?src-supplier=Digi-Key; ComponentLink3URL: https://datasheet.ciiva.com/2525/dcrcwe3-2525460.pdf?src-supplier=Digi-Key; ComponentLink3Description: https://datasheet.ciiva.com/2525/dcrcwe3-2525460.pdf?src-supplier=Digi-Key; ComponentLink4URL: https://datasheet.ciiva.com/16200/dcrcw-16200587.pdf?src-supplier=Future+Electronics; ComponentLink4Description: https://datasheet.ciiva.com/16200/dcrcw-16200587.pdf?src-supplier=Future+Electronics; ComponentLink5URL: https://datasheet.ciiva.com/22706/1697337-22706251.pdf?src-supplier=Element14; ComponentLink5Description: https://datasheet.ciiva.com/22706/1697337-22706251.pdf?src-supplier=Element14; ComponentLink6URL: https://datasheet.ciiva.com/5548/dcrcwe3-109170-5548701.pdf?src-supplier=Mouser; ComponentLink6Description: https://datasheet.ciiva.com/5548/dcrcwe3-109170-5548701.pdf?src-supplier=Mouser; ComponentLink7URL: https://datasheet.ciiva.com/7670/1697337-7670847.pdf?src-supplier=Element14; ComponentLink7Description: https://datasheet.ciiva.com/7670/1697337-7670847.pdf?src-supplier=Element14; ComponentLink8URL: https://datasheet.ciiva.com/7792/125364-7792335.pdf?src-supplier=Element14; ComponentLink8Description: https://datasheet.ciiva.com/7792/125364-7792335.pdf?src-supplier=Element14
R19 = CMP-2002-00680-1: SMD Chip Resistor, 0402 [1005 Metric], 140 kohm, ERJ2R Series, 50 V, Thick Film, 100 mW, 1%; Part Number: ERJ-2RKF1403X; Manufacturer: Panasonic; Resistance: 140kR; Temperature Coefficient: 100ppm/°C; Power Rating: 100mW; Voltage Rating: 50V; Supplier 1: Digi-Key; Supplier Part Number 1: P140KLCT-ND; Manufacturer Part Number: ERJ-2RKF1403X; RoHS: Yes; Category: Chip SMD Resistors; Stock 1: 38868; Pricing 1: 1=0.10000, 10=0.02400, 100=0.00990, 1000=0.00443, 2500=0.00384, 5000=0.00318 (USD); Mount: Surface Mount; Case/Package: 0402; Case Code (Imperial): 0402; Case Code (Metric): 1005; Contact Plating: Tin; Min Operating Temperature: -55°C; Max Operating Temperature: 155°C; Tolerance: 1%; Packaging: Tape and Reel; Resistor Type: Thick Film; Series: ERJ; Number of Terminations: 2; Max Power Dissipation: 100mW; Voltage Rating (DC): 50V; Features: Automotive AEC-Q200; Package Quantity: 1; Termination: SMD/SMT; Construction: Rectangular; Resistance Tolerance: 1%; Length: 1mm; Width: 0.5mm; Height: 0.016inch; Depth: 0.5mm; Radiation Hardening: No; RoHS Compliant: Yes; Lead Free: Lead Free; REACH SVHC: No SVHC; Military Standard: Not; ComponentLink1URL: https://datasheet.ciiva.com/7853/aoa0000ce2-7853685.pdf?src-supplier=Element14; ComponentLink1Description: https://datasheet.ciiva.com/7853/aoa0000ce2-7853685.pdf?src-supplier=Element14; ComponentLink2URL: https://datasheet.ciiva.com/9119/aoa0000ce2-9119191.pdf?src-supplier=Avnet; ComponentLink2Description: https://datasheet.ciiva.com/9119/aoa0000ce2-9119191.pdf?src-supplier=Avnet; ComponentLink3URL: https://datasheet.ciiva.com/30059/aoa0000ce2-30059975.pdf?src-supplier=Onlinecomponents.com; ComponentLink3Description: https://datasheet.ciiva.com/30059/aoa0000ce2-30059975.pdf?src-supplier=Onlinecomponents.com; ComponentLink4URL: https://datasheet.ciiva.com/22755/1678782-22755176.pdf?src-supplier=Farnell; ComponentLink4Description: https://datasheet.ciiva.com/22755/1678782-22755176.pdf?src-supplier=Farnell; ComponentLink5URL: https://datasheet.ciiva.com/22673/1678782-22673738.pdf?src-supplier=Element14; ComponentLink5Description: https://datasheet.ciiva.com/22673/1678782-22673738.pdf?src-supplier=Element14; ComponentLink6URL: https://datasheet.ciiva.com/46373/1678782-46373260.pdf?src-supplier=Element14; ComponentLink6Description: https://datasheet.ciiva.com/46373/1678782-46373260.pdf?src-supplier=Element14; ComponentLink7URL: https://datasheet.ciiva.com/46373/1678782-46373261.pdf?src-supplier=Element14; ComponentLink7Description: https://datasheet.ciiva.com/46373/1678782-46373261.pdf?src-supplier=Element14